# Altium schematic sheet Circuit.SchDoc
size D
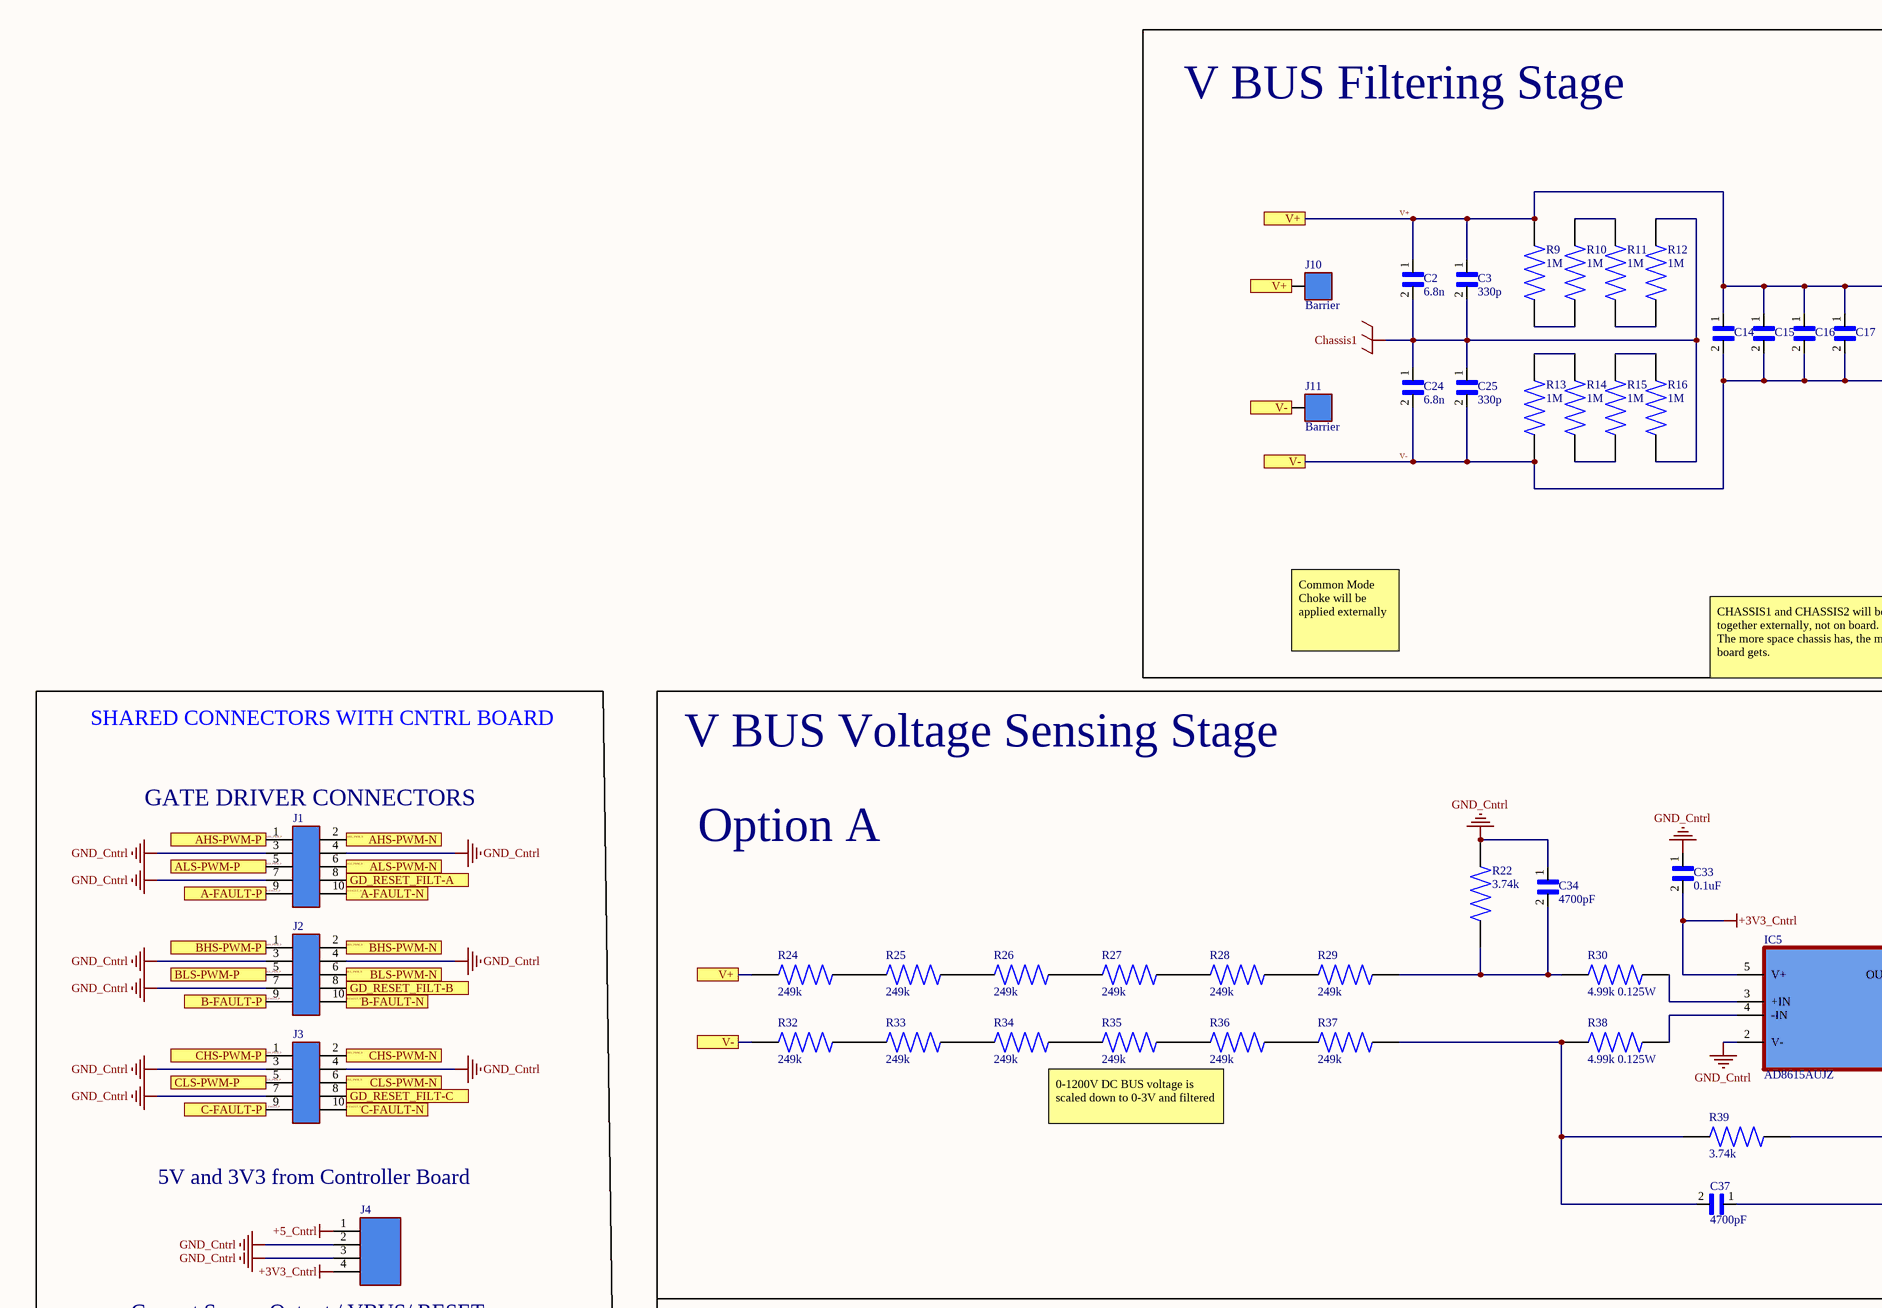
[diagram p0: Circuit.SchDoc, top left]
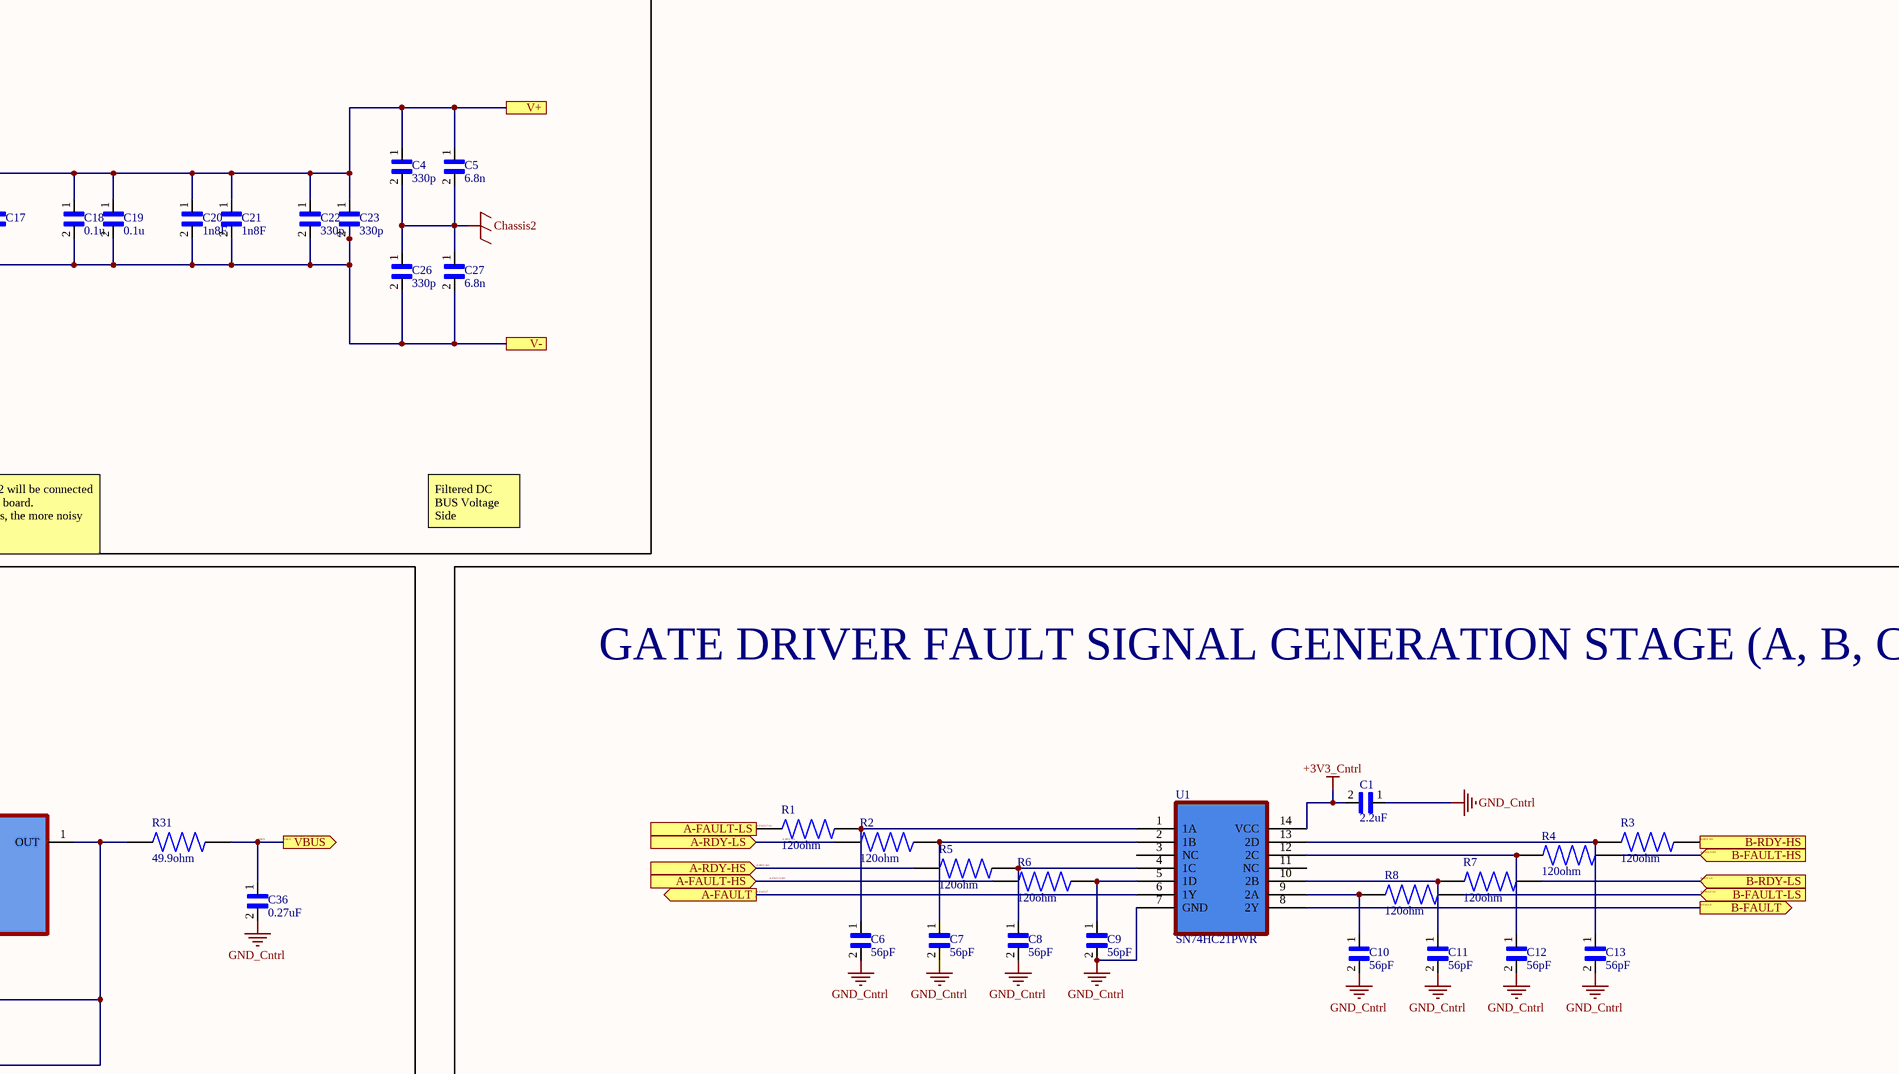
[diagram p1: Circuit.SchDoc, top right]
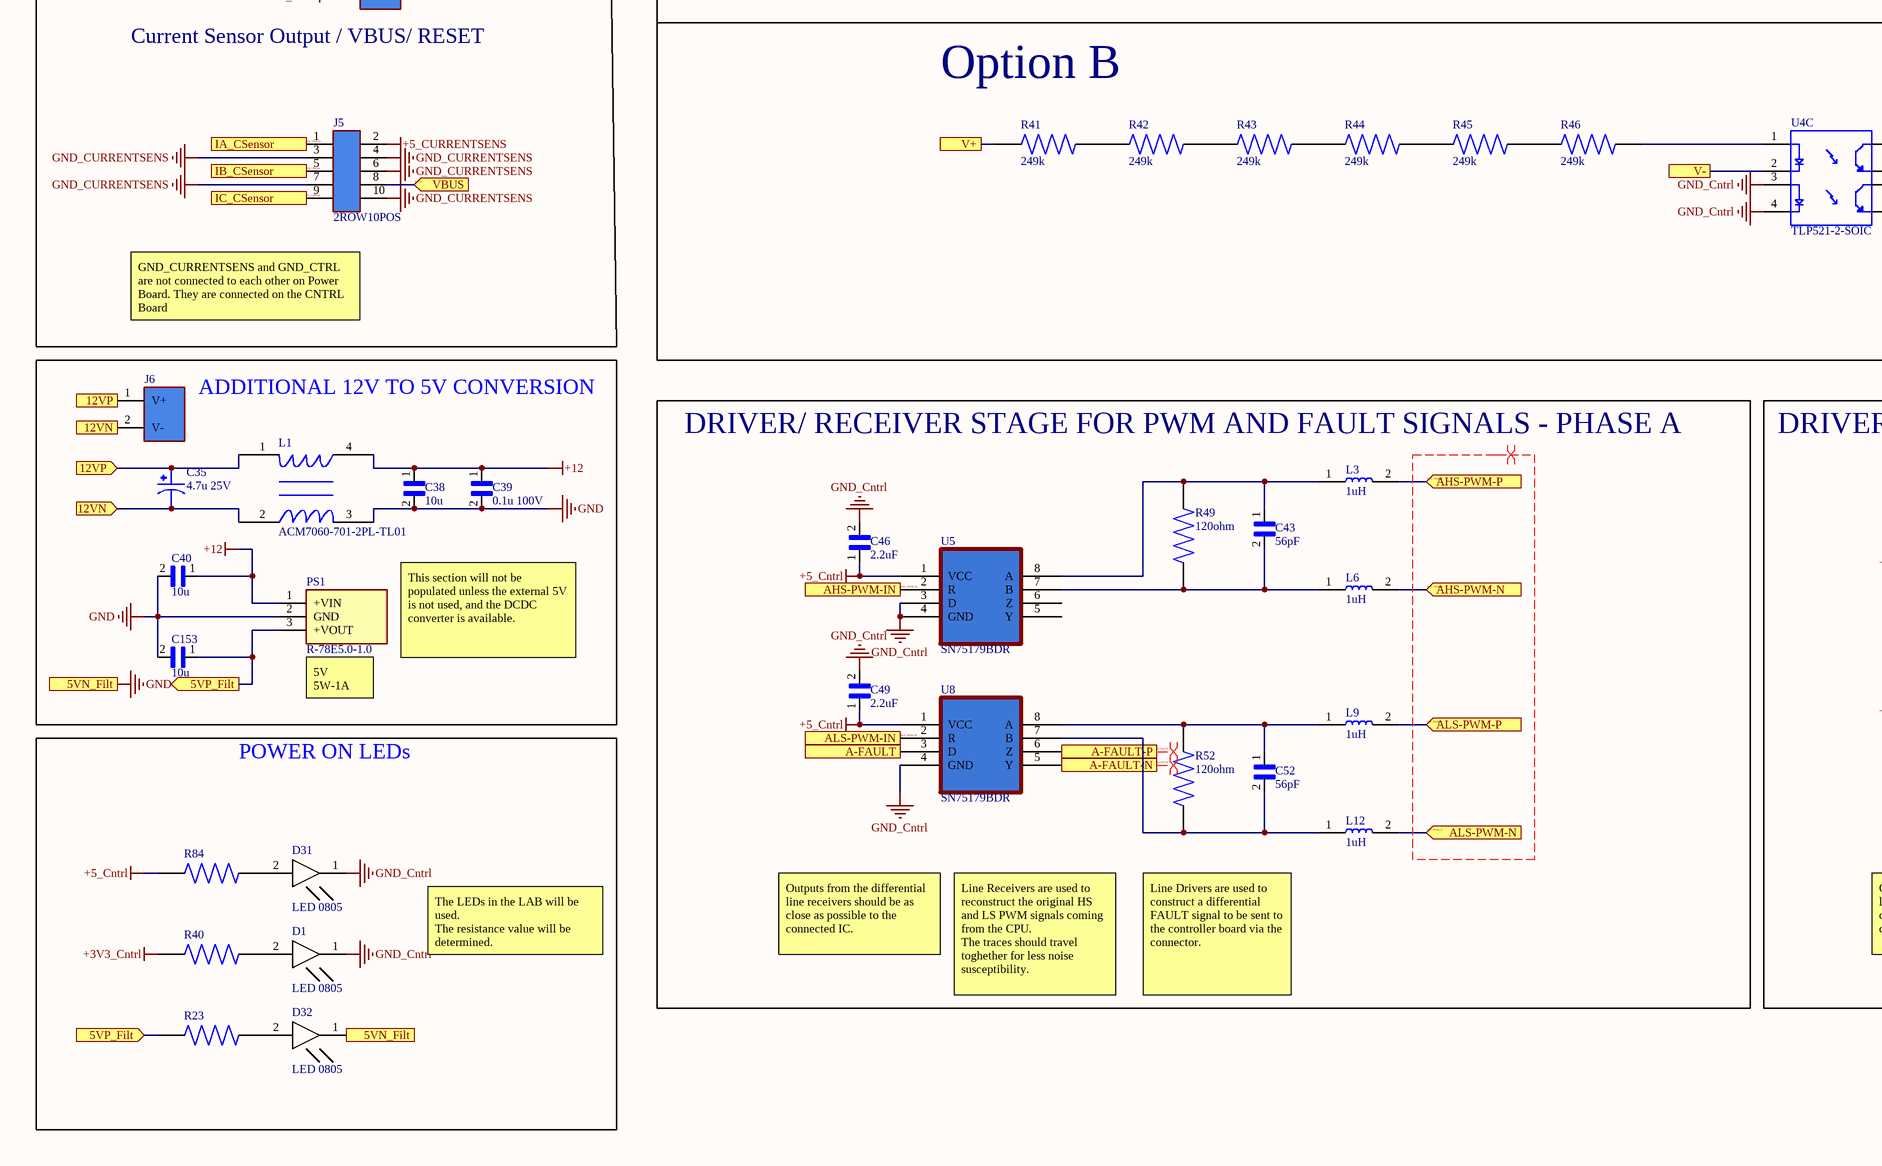
[diagram p2: Circuit.SchDoc, bottom left]
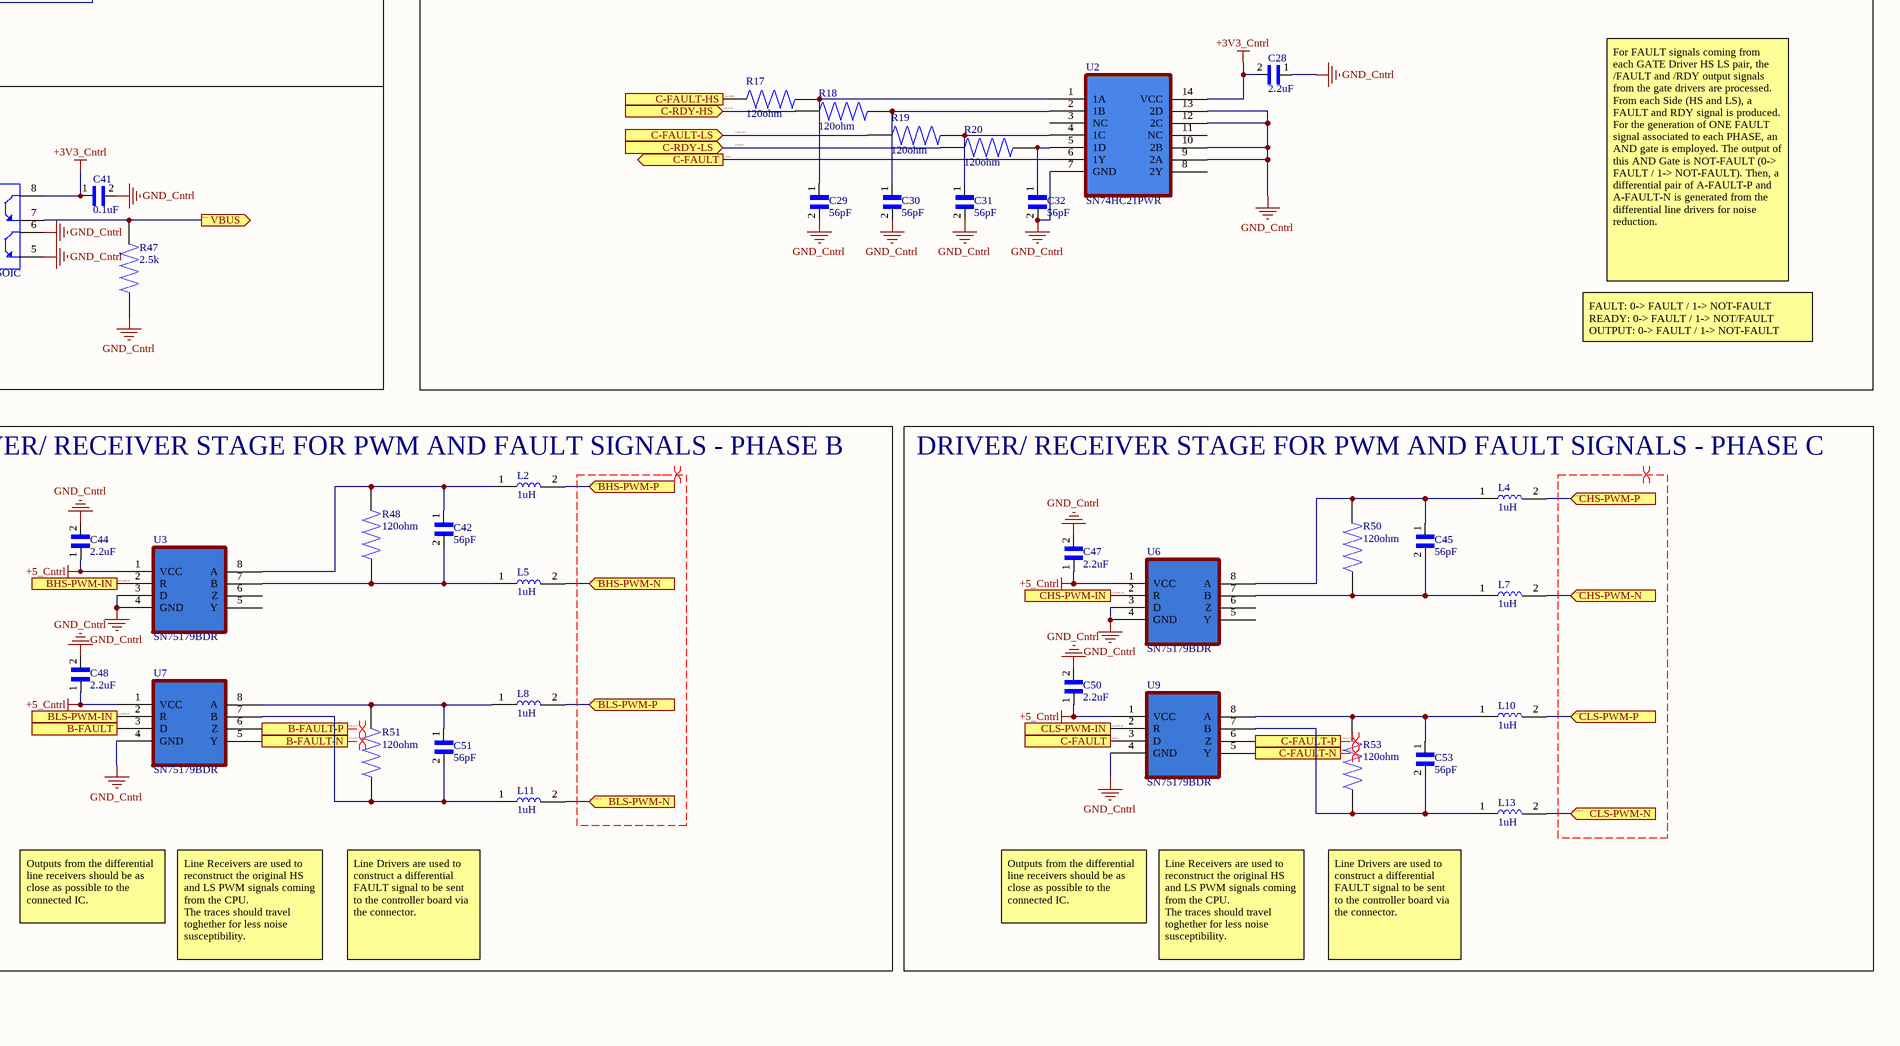
[diagram p3: Circuit.SchDoc, bottom right]

## Parts
C1  2.2uF  [CAP 0805]
C2  6.8n  [6.8nF 1600VDC]
C3  330p  [330p 1000VDC]
C4  330p  [330p 1000VDC]
C5  6.8n  [6.8nF 1600VDC]
C6  56pF  [CAP 0805]
C7  56pF  [CAP 0805]
C8  56pF  [CAP 0805]
C9  56pF  [CAP 0805]
C10  56pF  [CAP 0805]
C11  56pF  [CAP 0805]
C12  56pF  [CAP 0805]
C13  56pF  [CAP 0805]
C14  20u 800VDC  [20u 800VDC v3]  (value not drawn)
C15  20u 800VDC  [20u 800VDC v3]  (value not drawn)
C16  20u 800VDC  [20u 800VDC v3]  (value not drawn)
C17  20u 800VDC  [20u 800VDC v3]  (value not drawn)
C18  0.1u  [0.1uF 630VDC]
C19  0.1u  [0.1uF 630VDC]
C20  1n8F  [1nF 100VDC]
C21  1n8F  [1nF 100VDC]
C22  330p  [330p 1000VDC]
C23  330p  [330p 1000VDC]
C24  6.8n  [6.8nF 1600VDC]
C25  330p  [330p 1000VDC]
C26  330p  [330p 1000VDC]
C27  6.8n  [6.8nF 1600VDC]
C28  2.2uF  [CAP 0805]
C29  56pF  [CAP 0805]
C30  56pF  [CAP 0805]
C31  56pF  [CAP 0805]
C32  56pF  [CAP 0805]
C33  0.1uF  [CAP 0805]
C34  4700pF  [CAP 0805]
C35  4.7u 25V  [EEE-HC1E470XP]
C36  0.27uF  [CAP 0805]
C37  4700pF  [CAP 0805]
C38  10u  [CAP 0805]
C39  0.1u 100V  [CAP 0805]
C40  10u  [CAP 0805]
C41  0.1uF  [CAP 0805]
C42  56pF  [CAP 0805]
C43  56pF  [CAP 0805]
C44  2.2uF  [CAP 0805]
C45  56pF  [CAP 0805]
C46  2.2uF  [CAP 0805]
C47  2.2uF  [CAP 0805]
C48  2.2uF  [CAP 0805]
C49  2.2uF  [CAP 0805]
C50  2.2uF  [CAP 0805]
C51  56pF  [CAP 0805]
C52  56pF  [CAP 0805]
C53  56pF  [CAP 0805]
C153  10u  [CAP 0805]
D1  LED 0805  [LED 0805]
D31  LED 0805  [LED 0805]
D32  LED 0805  [LED 0805]
IC5  AD8615AUJZ  [AD8615AUJZ]
J1  2ROW10POS  [2ROW10POS]  (value not drawn)
J2  2ROW10POS  [2ROW10POS]  (value not drawn)
J3  2ROW10POS  [2ROW10POS]  (value not drawn)
J4  4POS1ROW  [4POS1ROW]  (value not drawn)
J5  2ROW10POS  [2ROW10POS]
J6  2 POS CONN  [2POS CONN]  (value not drawn)
J10  Barrier  [Barrier]
J11  Barrier  [Barrier]
L1  ACM7060-701-2PL-TL01  [ACM7060-701-2PL-TL01]
L2  1uH  [IND 0805]
L3  1uH  [IND 0805]
L4  1uH  [IND 0805]
L5  1uH  [IND 0805]
L6  1uH  [IND 0805]
L7  1uH  [IND 0805]
L8  1uH  [IND 0805]
L9  1uH  [IND 0805]
L10  1uH  [IND 0805]
L11  1uH  [IND 0805]
L12  1uH  [IND 0805]
L13  1uH  [IND 0805]
PS1  R-78E5.0-1.0  [R78E5010]
R1  120ohm  [RES 0805 (2012 metric)]
R2  120ohm  [RES 0805 (2012 metric)]
R3  120ohm  [RES 0805 (2012 metric)]
R4  120ohm  [RES 0805 (2012 metric)]
R5  120ohm  [RES 0805 (2012 metric)]
R6  120ohm  [RES 0805 (2012 metric)]
R7  120ohm  [RES 0805 (2012 metric)]
R8  120ohm  [RES 0805 (2012 metric)]
R9  1M  [RESC3116X65N]
R10  1M  [RESC3116X65N]
R11  1M  [RESC3116X65N]
R12  1M  [RESC3116X65N]
R13  1M  [RESC3116X65N]
R14  1M  [RESC3116X65N]
R15  1M  [RESC3116X65N]
R16  1M  [RESC3116X65N]
R17  120ohm  [RES 0805 (2012 metric)]
R18  120ohm  [RES 0805 (2012 metric)]
R19  120ohm  [RES 0805 (2012 metric)]
R20  120ohm  [RES 0805 (2012 metric)]
R22  3.74k  [RES 0805 (2012 metric)]
R23  1.24k  [RES 0805 (2012 metric)]  (value not drawn)
R24  249k  [1206RES]
R25  249k  [1206RES]
R26  249k  [1206RES]
R27  249k  [1206RES]
R28  249k  [1206RES]
R29  249k  [1206RES]
R30  4.99k 0.125W  [RES 0805 (2012 metric)]
R31  49.9ohm  [RES 0805 (2012 metric)]
R32  249k  [1206RES]
R33  249k  [1206RES]
R34  249k  [1206RES]
R35  249k  [1206RES]
R36  249k  [1206RES]
R37  249k  [1206RES]
R38  4.99k 0.125W  [RES 0805 (2012 metric)]
R39  3.74k  [RES 0805 (2012 metric)]
R40  1.24k  [RES 0805 (2012 metric)]  (value not drawn)
R41  249k  [1206RES]
R42  249k  [1206RES]
R43  249k  [1206RES]
R44  249k  [1206RES]
R45  249k  [1206RES]
R46  249k  [1206RES]
R47  2.5k  [RES 0805 (2012 metric)]
R48  120ohm  [RES 0805 (2012 metric)]
R49  120ohm  [RES 0805 (2012 metric)]
R50  120ohm  [RES 0805 (2012 metric)]
R51  120ohm  [RES 0805 (2012 metric)]
R52  120ohm  [RES 0805 (2012 metric)]
R53  120ohm  [RES 0805 (2012 metric)]
R84  1.24k  [RES 0805 (2012 metric)]  (value not drawn)
U1  SN74HC21PWR  [SN74HC21PWR]
U2  SN74HC21PWR  [SN74HC21PWR]
U3  SN75179BDR  [SN75179BDR]
U4  TLP521-2-SOIC  [TLP521-2-SOIC]  (part C of 3)
U5  SN75179BDR  [SN75179BDR]
U6  SN75179BDR  [SN75179BDR]
U7  SN75179BDR  [SN75179BDR]
U8  SN75179BDR  [SN75179BDR]
U9  SN75179BDR  [SN75179BDR]

## Blocks framed on the sheet
V BUS Filtering Stage: C2-C5 C14-C27 J10 J11 R9-R16
GATE DRIVER CONNECTORS: J1-J5
GATE DRIVER FAULT SIGNAL GENERATION STAGE (A, B, C): C1 C6-C13 C28-C32 R1-R8 R17-R20 U1 U2
ADDITIONAL 12V TO 5V CONVERSION: C35 C38-C40 C153 J6 L1 PS1
DRIVER/ RECEIVER STAGE FOR PWM AND FAULT SIGNALS - PHASE A: C43 C46 C49 C52 L3 L6 L9 L12 R49 R52 U5 U8
DRIVER/ RECEIVER STAGE FOR PWM AND FAULT SIGNALS - PHASE B: C42 C44 C48 C51 L2 L5 L8 L11 R48 R51 U3 U7
DRIVER/ RECEIVER STAGE FOR PWM AND FAULT SIGNALS - PHASE C: C45 C47 C50 C53 L4 L7 L10 L13 R50 R53 U6 U9
POWER ON LEDs: D1 D31 D32 R23 R40 R84

## Ports
5VN_Filt (out), 5VP_Filt (in), 5VP_Filt (out), 12VN (in), 12VP (in), A-FAULT (in), A-FAULT (out), A-FAULT-HS (in), A-FAULT-LS (in), A-FAULT-N (in), A-FAULT-N (out), A-FAULT-P (in), A-FAULT-P (out), A-RDY-HS (in), A-RDY-LS (in), AHS-PWM-IN (out), AHS-PWM-N (in), AHS-PWM-N (out), AHS-PWM-P (in), AHS-PWM-P (out), ALS-PWM-IN (out), ALS-PWM-N (in), ALS-PWM-N (out), ALS-PWM-P (in), ALS-PWM-P (out), B-FAULT (in), B-FAULT (out), B-FAULT-HS (in), B-FAULT-LS (in), B-FAULT-N (in), B-FAULT-N (out), B-FAULT-P (in), B-FAULT-P (out), B-RDY-HS (in), B-RDY-LS (in), BHS-PWM-IN (out), BHS-PWM-N (in), BHS-PWM-N (out), BHS-PWM-P (in), BHS-PWM-P (out), BLS-PWM-IN (out), BLS-PWM-N (in), BLS-PWM-N (out), BLS-PWM-P (in), BLS-PWM-P (out), C-FAULT (in), C-FAULT (out), C-FAULT-HS (in), C-FAULT-LS (in), C-FAULT-N (in), C-FAULT-N (out), C-FAULT-P (in), C-FAULT-P (out), C-RDY-HS (in), C-RDY-LS (in), CHS-PWM-IN (out), CHS-PWM-N (in), CHS-PWM-N (out), CHS-PWM-P (in), CHS-PWM-P (out), CLS-PWM-IN (out), CLS-PWM-N (in), CLS-PWM-N (out), CLS-PWM-P (in), CLS-PWM-P (out), GD_RESET_FILT-A (in), GD_RESET_FILT-B (in), GD_RESET_FILT-C (in), IA_CSensor (in), IB_CSensor (in), IC_CSensor (in), V+, V-, VBUS (in), VBUS (out)

## Nets
+3V3_Cntrl: C1.2 C28.2 C33.2 C41.1 IC5.5(V+) J4.4 R40.2 U1.14(VCC) U2.14(VCC) U4.8
+5_Cntrl: C44.1 C46.1 C47.1 C48.1 C49.1 C50.1 J4.1 R84.2 U3.1(VCC) U5.1(VCC) U6.1(VCC) U7.1(VCC) U8.1(VCC) U9.1(VCC)
+5_CURRENTSENS: J5.2
+12: C38.1 C39.1 C40.1 L1.4 PS1.1(+VIN)
Chassis1: C2.2 C3.2 C24.1 C25.1 R12.2 R16.1
Chassis2: C4.2 C5.2 C26.1 C27.1
GND: C38.2 C39.2 C40.2 C153.2 D32.1(Cathode) L1.3 PS1.2(GND) ; port 5VN_Filt
GND_Cntrl: C1.1 C6.2 C7.2 C8.2 C9.2 C10.2 C11.2 C12.2 C13.2 C28.1 C29.2 C30.2 C31.2 C32.2 C33.1 C34.1 C36.2 C41.2 C44.2 C46.2 C47.2 C48.2 C49.2 C50.2 D1.1(Cathode) D31.1(Cathode) IC5.2(V-) J1.3 J1.4 J1.7 J2.3 J2.4 J2.7 J3.3 J3.4 J3.7 J4.2 J4.3 R22.2 R47.1 U1.7(GND) U2.7(GND) U2.9(2A) U2.10(2B) U2.12(2C) U2.13(2D) U3.3(D) U3.4(GND) U4.3 U4.4 U4.5 U4.6 U5.3(D) U5.4(GND) U6.3(D) U6.4(GND) U7.4(GND) U8.4(GND) U9.4(GND)
GND_CURRENTSENS: J5.3 J5.4 J5.6 J5.7 J5.10
5VP_Filt: C153.1 PS1.3(+VOUT) R23.2 ; port 5VP_Filt
12VN: C35.2 J6.2(V-) L1.2 ; port 12VN
12VP: C35.1 J6.1(V+) L1.1 ; port 12VP
A-FAULT: U1.6(1Y) U8.3(D) ; port A-FAULT
A-FAULT-HS: R6.1 ; port A-FAULT-HS
A-FAULT-LS: R1.1 ; port A-FAULT-LS
A-FAULT_N: J1.10 U8.5(Y) ; port A-FAULT-N
A-FAULT_P: J1.9 U8.6(Z) ; port A-FAULT-P
A-RDY-HS: R5.1 ; port A-RDY-HS
A-RDY-LS: R2.1 ; port A-RDY-LS
AHS_PWM_IN: U5.2(R) ; port AHS-PWM-IN
AHS_PWM_N: J1.2 L6.2 ; port AHS-PWM-N
AHS_PWM_P: J1.1 L3.2 ; port AHS-PWM-P
ALS_PWM_IN: U8.2(R) ; port ALS-PWM-IN
ALS_PWM_N: J1.6 L12.2 ; port ALS-PWM-N
ALS_PWM_P: J1.5 L9.2 ; port ALS-PWM-P
B-FAULT: U1.8(2Y) U7.3(D) ; port B-FAULT
B-FAULT-HS: R4.2 ; port B-FAULT-HS
B-FAULT-LS: R8.2 ; port B-FAULT-LS
B-FAULT_N: J2.10 U7.5(Y) ; port B-FAULT-N
B-FAULT_P: J2.9 U7.6(Z) ; port B-FAULT-P
B-RDY-HS: R3.2 ; port B-RDY-HS
B-RDY-LS: R7.2 ; port B-RDY-LS
BHS_PWM_IN: U3.2(R) ; port BHS-PWM-IN
BHS_PWM_N: J2.2 L5.2 ; port BHS-PWM-N
BHS_PWM_P: J2.1 L2.2 ; port BHS-PWM-P
BLS_PWM_IN: U7.2(R) ; port BLS-PWM-IN
BLS_PWM_N: J2.6 L11.2 ; port BLS-PWM-N
BLS_PWM_P: J2.5 L8.2 ; port BLS-PWM-P
C-FAULT: U2.6(1Y) U9.3(D) ; port C-FAULT
C-FAULT-HS: R17.1 ; port C-FAULT-HS
C-FAULT-LS: R19.1 ; port C-FAULT-LS
C-FAULT_N: J3.10 U9.5(Y) ; port C-FAULT-N
C-FAULT_P: J3.9 U9.6(Z) ; port C-FAULT-P
C-RDY-HS: R18.1 ; port C-RDY-HS
C-RDY-LS: R20.1 ; port C-RDY-LS
CHS_PWM_IN: U6.2(R) ; port CHS-PWM-IN
CHS_PWM_N: J3.2 L7.2 ; port CHS-PWM-N
CHS_PWM_P: J3.1 L4.2 ; port CHS-PWM-P
CLS_PWM_IN: U9.2(R) ; port CLS-PWM-IN
CLS_PWM_N: J3.6 L13.2 ; port CLS-PWM-N
CLS_PWM_P: J3.5 L10.2 ; port CLS-PWM-P
GD_RESET_FILT-A: J1.8 ; port GD_RESET_FILT-A
GD_RESET_FILT-B: J2.8 ; port GD_RESET_FILT-B
GD_RESET_FILT-C: J3.8 ; port GD_RESET_FILT-C
V+: C2.1 C3.1 C4.1 C5.1 C14.1 C15.1 C16.1 C17.1 C18.1 C19.1 C20.1 C21.1 C22.1 C23.1 J10.1 R9.2 R24.1 R41.1 ; port V+
V-: C14.2 C15.2 C16.2 C17.2 C18.2 C19.2 C20.2 C21.2 C22.2 C23.2 C24.2 C25.2 C26.2 C27.2 J11.1 R13.1 R32.1 U4.2 ; port V-
VA_CSensor: J5.1 ; port IA_CSensor
VB_CSensor: J5.5 ; port IB_CSensor
VBUS: C36.1 J5.8 R31.2 R47.2 U4.7 ; port VBUS
VC_CSensor: J5.9 ; port IC_CSensor
NetC6_1: C6.1 R1.2 U1.1(1A)
NetC7_1: C7.1 R2.2 U1.2(1B)
NetC8_1: C8.1 R5.2 U1.4(1C)
NetC9_1: C9.1 R6.2 U1.5(1D)
NetC10_1: C10.1 R8.1 U1.9(2A)
NetC11_1: C11.1 R7.1 U1.10(2B)
NetC12_1: C12.1 R4.1 U1.12(2C)
NetC13_1: C13.1 R3.1 U1.13(2D)
NetC29_1: C29.1 R17.2 U2.1(1A)
NetC30_1: C30.1 R18.2 U2.2(1B)
NetC31_1: C31.1 R19.2 U2.4(1C)
NetC32_1: C32.1 R20.2 U2.5(1D)
NetC34_2: C34.2 R22.1 R29.2 R30.1
NetC37_1: C37.1 IC5.1(OUT) R31.1 R39.1
NetC37_2: C37.2 R37.2 R38.1 R39.2
NetC42_1: C42.1 L2.1 R48.2 U3.8(A)
NetC42_2: C42.2 L5.1 R48.1 U3.7(B)
NetC43_1: C43.1 L3.1 R49.2 U5.8(A)
NetC43_2: C43.2 L6.1 R49.1 U5.7(B)
NetC45_1: C45.1 L4.1 R50.2 U6.8(A)
NetC45_2: C45.2 L7.1 R50.1 U6.7(B)
NetC51_1: C51.1 L8.1 R51.2 U7.8(A)
NetC51_2: C51.2 L11.1 R51.1 U7.7(B)
NetC52_1: C52.1 L9.1 R52.2 U8.8(A)
NetC52_2: C52.2 L12.1 R52.1 U8.7(B)
NetC53_1: C53.1 L10.1 R53.2 U9.8(A)
NetC53_2: C53.2 L13.1 R53.1 U9.7(B)
NetD1_2: D1.2(Anode) R40.1
NetD31_2: D31.2(Anode) R84.1
NetD32_2: D32.2(Anode) R23.1
NetIC5_3: IC5.3(+IN) R30.2
NetIC5_4: IC5.4(-IN) R38.2
NetR9_1: R9.1 R10.1
NetR10_2: R10.2 R11.2
NetR11_1: R11.1 R12.1
NetR13_2: R13.2 R14.2
NetR14_1: R14.1 R15.1
NetR15_2: R15.2 R16.2
NetR24_2: R24.2 R25.1
NetR25_2: R25.2 R26.1
NetR26_2: R26.2 R27.1
NetR27_2: R27.2 R28.1
NetR28_2: R28.2 R29.1
NetR32_2: R32.2 R33.1
NetR33_2: R33.2 R34.1
NetR34_2: R34.2 R35.1
NetR35_2: R35.2 R36.1
NetR36_2: R36.2 R37.1
NetR41_2: R41.2 R42.1
NetR42_2: R42.2 R43.1
NetR43_2: R43.2 R44.1
NetR44_2: R44.2 R45.1
NetR45_2: R45.2 R46.1
NetR46_2: R46.2 U4.1

Not connected (* = marked no-connect by the designer): U1 3(NC) 11(NC); U2 3(NC) 8(2Y) 11(NC); U3 5(Y) 6(Z); U5 5(Y) 6(Z); U6 5(Y) 6(Z)

## Layout directives
differential pair; differential pair class DIFF90: AHS_PWM_N, AHS_PWM_P, ALS_PWM_N, ALS_PWM_P, BHS_PWM_N, BHS_PWM_P, BLS_PWM_N, BLS_PWM_P, CHS_PWM_N, CHS_PWM_P, CLS_PWM_N, CLS_PWM_P
differential pair: A-FAULT_N, A-FAULT_P, B-FAULT_N, B-FAULT_P, C-FAULT_N, C-FAULT_P

## Notes on the sheet
- Common Mode Choke will be applied externally
- Filtered DC BUS Voltage Side
- CHASSIS1 and CHASSIS2 will be connected together externally, not on board.
  The more space chassis has, the more noisy the board gets.
- SHARED CONNECTORS WITH CNTRL BOARD
- V BUS Voltage Sensing Stage
- Option A
- 0-1200V DC BUS voltage is scaled down to 0-3V and filtered
- 5V and 3V3 from Controller Board
- (near J4) Current Sensor Output / VBUS/ RESET
- Option B
- For FAULT signals coming from each GATE Driver HS LS pair, the /FAULT and /RDY output signals from the gate drivers are processed. From each Side (HS and LS), a FAULT and RDY signal is produced. For the generation of ONE FAULT signal associated to each PHASE, an AND gate is employed. The output of this AND Gate is NOT-FAULT (0-> FAULT / 1-> NOT-FAULT). Then, a differential pair of A-FAULT-P and A-FAULT-N is generated from the differential line drivers for noise reduction.
- GND_CURRENTSENS and GND_CTRL are not connected to each other on Power Board. They are connected on the CNTRL Board
- FAULT: 0-> FAULT / 1-> NOT-FAULT
  READY: 0-> FAULT / 1-> NOT/FAULT
  OUTPUT: 0-> FAULT / 1-> NOT-FAULT
- This section will not be populated unless the external 5V is not used, and the DCDC converter is available.
- (near PS1) 5V
  5W-1A
- The LEDs in the LAB will be used.
  The resistance value will be determined.
- Outputs from the differential line receivers should be as close as possible to the connected IC.
- Line Receivers are used to reconstruct the original HS and LS PWM signals coming from the CPU.
  The traces should travel toghether for less noise susceptibility.
- Line Drivers are used to construct a differential FAULT signal to be sent to the controller board via the connector.

## Library data of the parts
C1 C28 C40 C44 C46-C50 C153 = 2.2uF 50V 0805
C2 C5 C24 C27 = 6.8nF 1600VDC
C3 C4 C22 C23 C25 C26 = C323A331K31C320: 330p 1000VDC
C6-C13 C29-C32 C42 C43 C45 C51-C53 = 56pF 0805: / 56 pF ±5% 100V Ceramic Capacitor C0G, NP0 0805 (2012 Metric
C18 C19 = 0.1uF 630VDC
C20 C21 = 1nF 100VDC: PHE850EA4100MA01R17
C33 C39 C41 = 0.1uF 0805
C34 C37 = 4700pF 0805: 4700pF 0805 cap
C35 = EEE-HC1E4
C36 = 0.27uF 0805
C38 = 0.1uF 0805: 10uF
L2-L13 = 1uH 0805: / 1 µH Shielded Multilayer Inductor 600 mA 150mOhm 0805(2012 metric)
PS1 = R-78E5.0-1.0: Power Supply; Manufacturer_Name: RECOM Power; Datasheet Link: http://www.recom-power.com/pdf/Innoline/R-78Exx-1.0.pdf; Height: 10.4mm; Manufacturer_Part_Number: R-78E5.0-1.0; Mouser Part Number: 919-R-78E5.0-1.0; Mouser Price/Stock: https://www.mouser.co.uk/ProductDetail/RECOM-Power/R-78E50-10/?qs=T0XSgvH75d4EsZCU9I5HVA%3D%3D; Arrow Part Number: R-78E5.0-1.0; Arrow Price/Stock: https://www.arrow.com/en/products/r-78e5.0-1.0/recom-power
R1-R8 R17-R20 R48-R53 = 120ohm 0805
R9-R16 = RE1206FRE071ML: RE1206 1,00M 1% 0,25W; Package: None; Price: None; Value: *; MP: RE1206FRE071ML; Availability: Unavailable
R22 R39 = 3.74k 0805: 3.74k 0805 resistor
R23 R40 R84 = 120ohm 0805: 1.24ohm 0805
R24-R29 R32-R37 R41-R46 = 249k 1206
R30 R38 = 4.99k 0.125W: 4.99k 0805 0.125W
R31 = 49.9ohm 0805
R47 = 2.5k 0805
U1 U2 = SN74HC21PWR: QUAD AND GATE
U3 U5-U9 = SN75179BDR: Differential Line Transceiver
U4 = TLP521